# Altium project diplom.PrjPcb
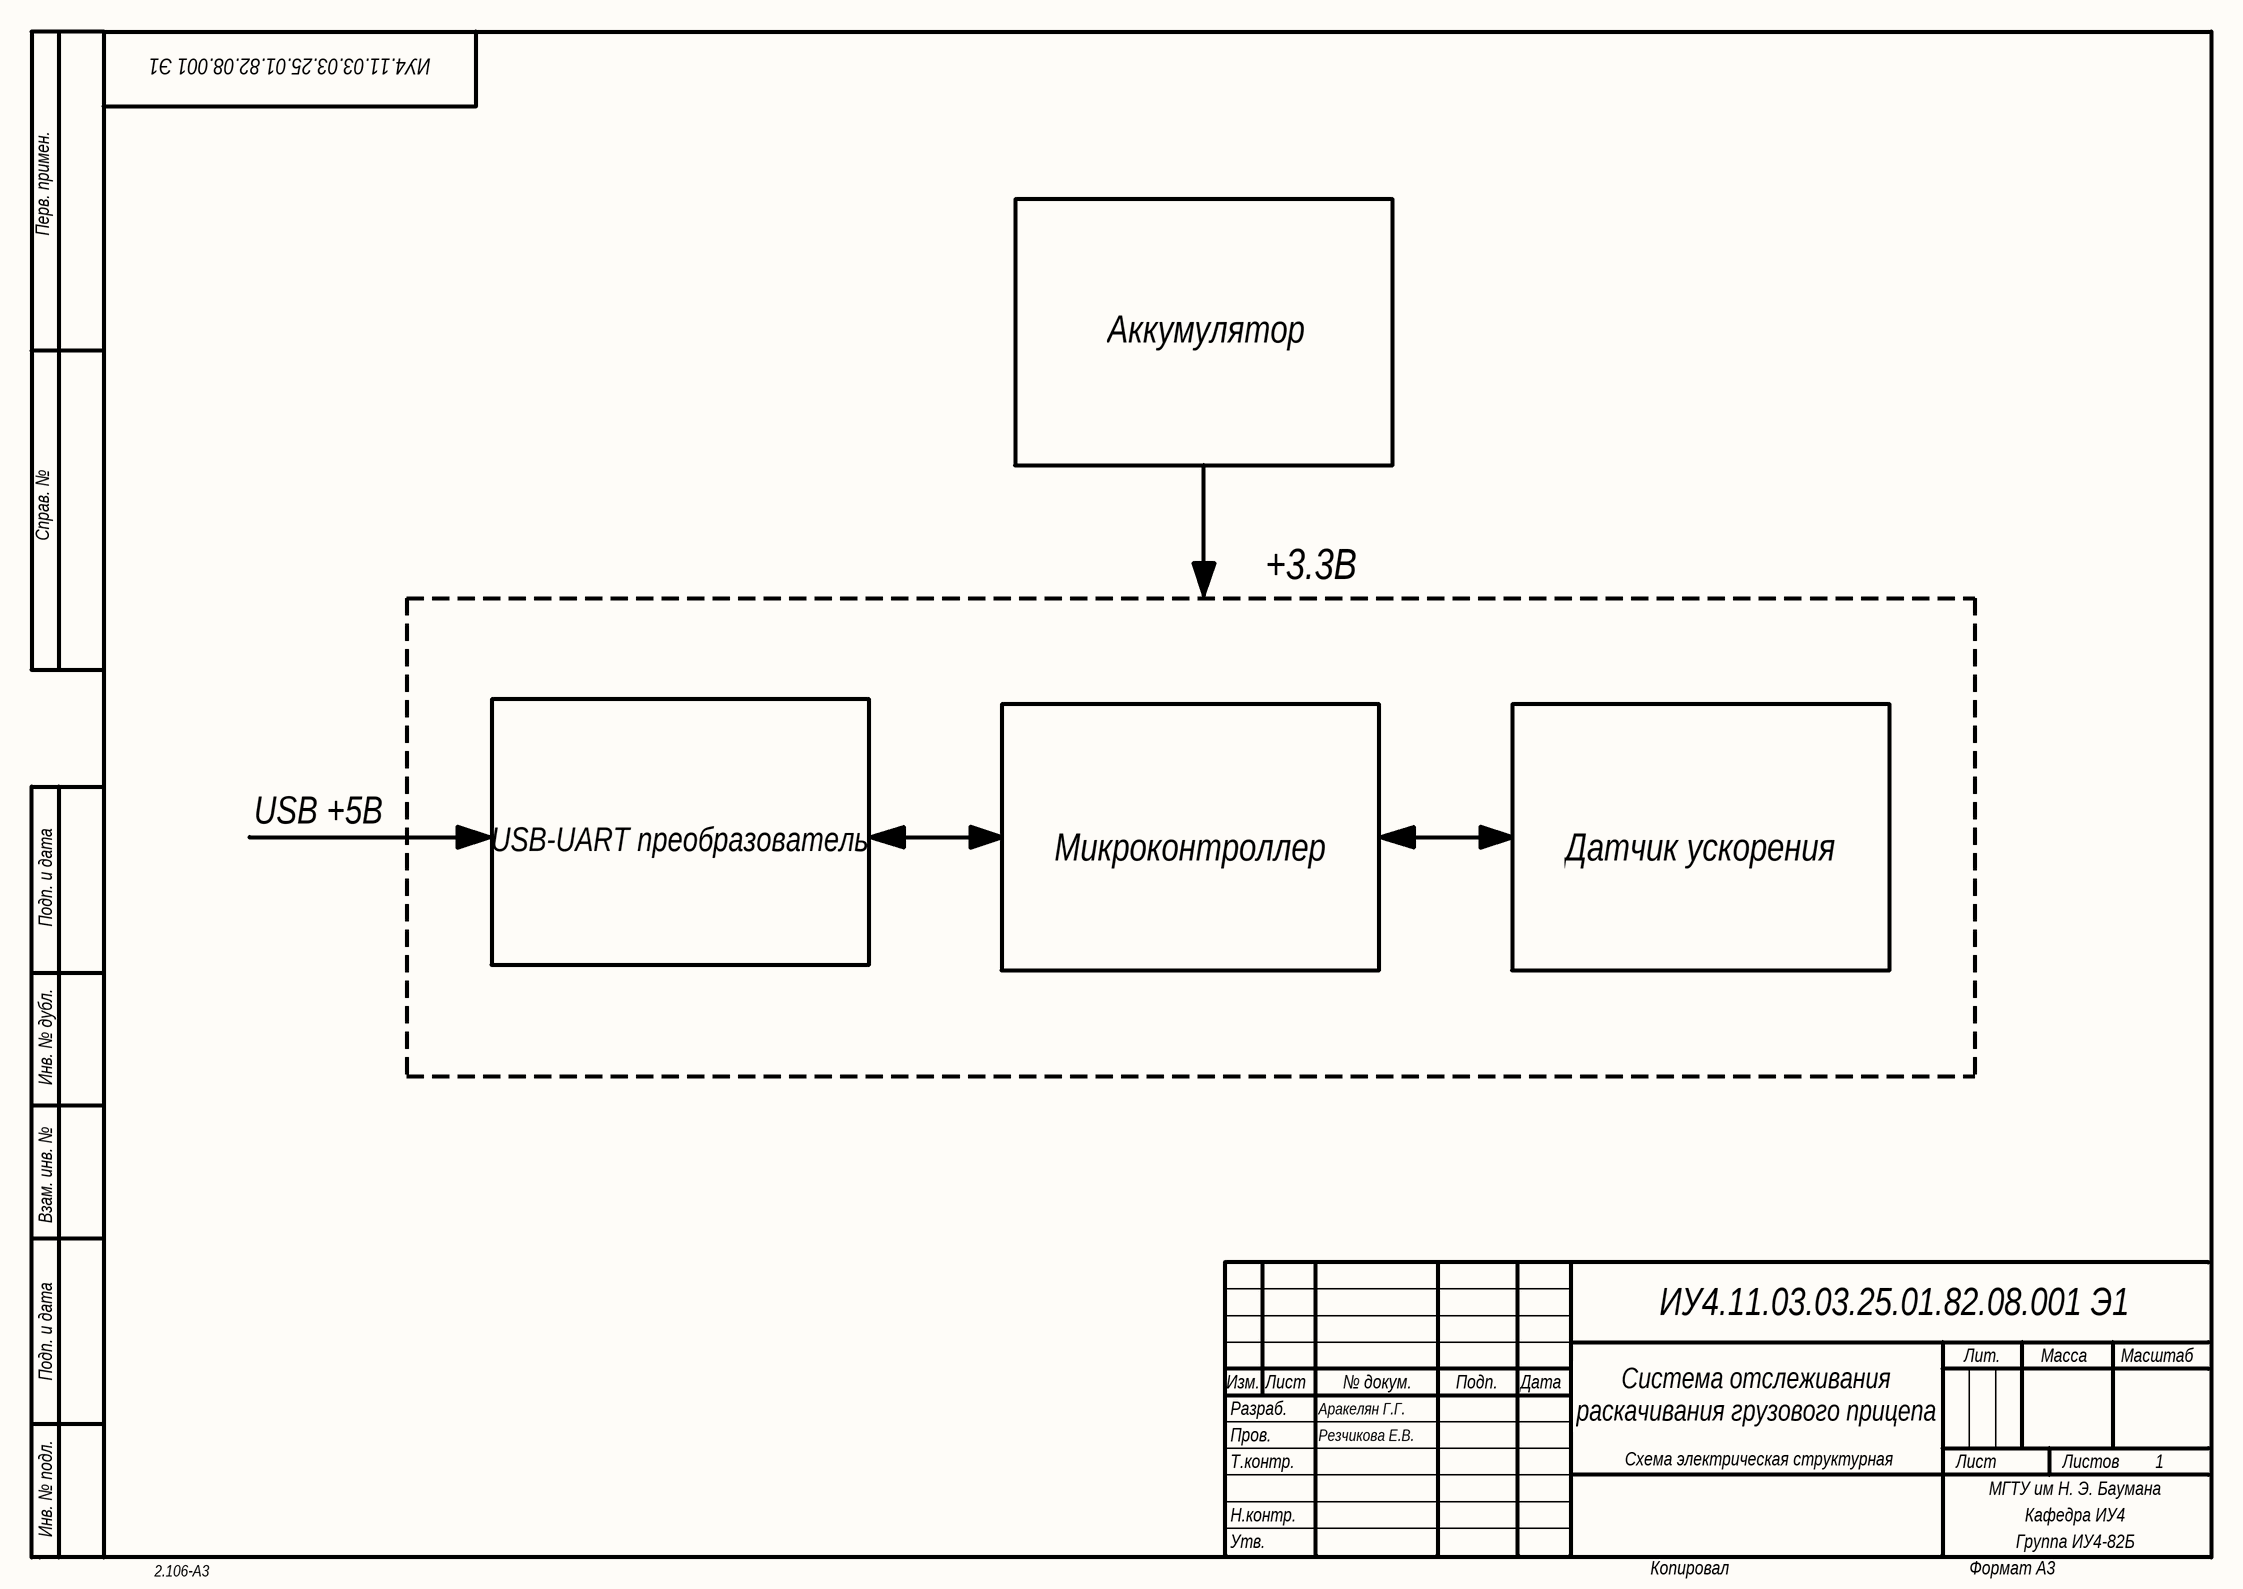
[diagram p0: Э1_diplom.SchDoc]
3 sheets, 40 parts. Net scope: global (net labels, ports and power ports of the same name join across sheets).
Board file: PCB1.PcbDoc
Sheets:
  Э1_diplom.SchDoc
  Э2_diplom.SchDoc
  Э3_diplom.SchDoc

## Sheet Э1_diplom.SchDoc
size 420 x 297 mm; CheckedBy: Резчикова Е.В.; Author: Аракелян Г.Г.; CompanyName: ИУ4.11.03.03.25.01.82.08.001 Э1; Address1: Схема электрическая структурная; SheetNumber: 1; SheetTotal: 3

### Notes on the sheet
- Аккумулятор
- +3.3В
- USB +5В
- USB-UART преобразователь
- Микроконтроллер
- Датчик ускорения
- Система отслеживания раскачивания грузового прицепа
- Перв. примен.
- Справ. №
- Подп. и дата
- Инв. № дубл.
- Взам. инв. №
- Разраб.
- Изм.
- Лист
- № докум.
- Подп.
- Дата
- Лит.
- Масса
- Масштаб
- Пров.
- Т.контр.
- Листов
- 1
- Инв. № подл.
- Утв.
- Н.контр.
- МГТУ им Н. Э. Баумана
- Группа ИУ4-82Б
- Кафедра ИУ4
- 2.106-A3
- Копировал
- Формат А3

## Sheet Э2_diplom.SchDoc
size 420 x 297 mm; CheckedBy: Резчикова Е.В.; Author: Аракелян Г.Г.; CompanyName: ИУ4.11.03.03.25.01.82.08.001 Э2; Address1: Схема электрическая функциональная; SheetNumber: 2; SheetTotal: 3
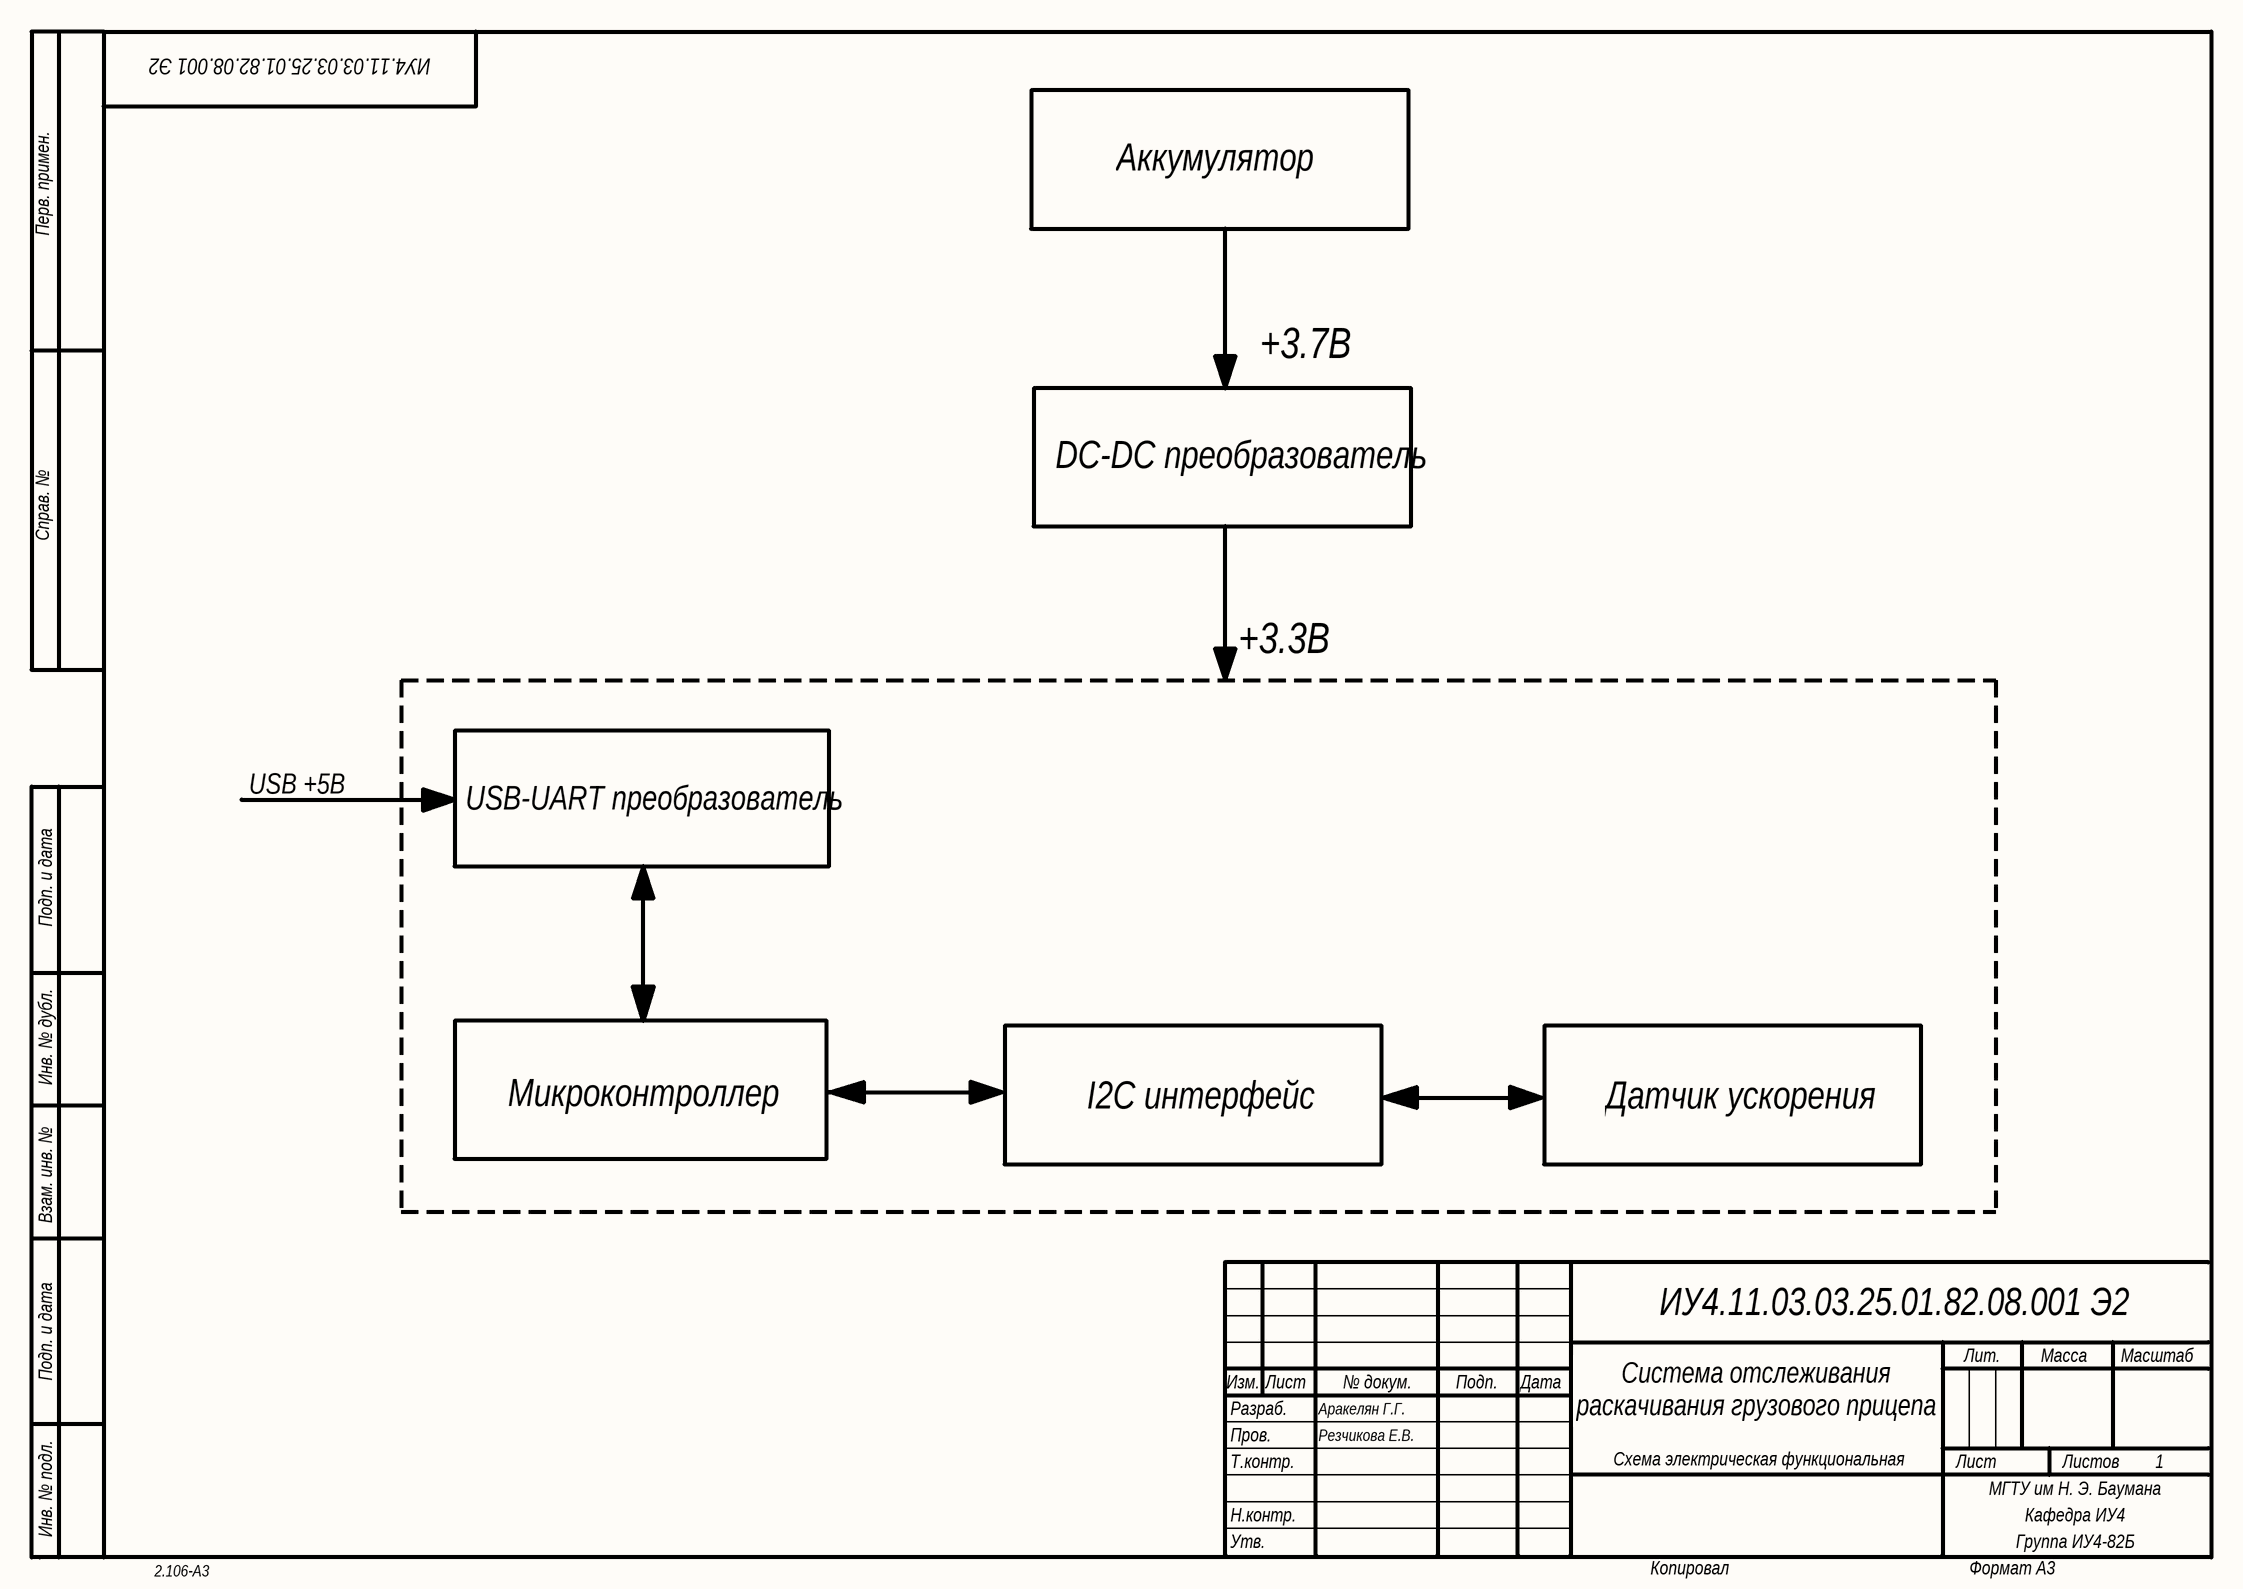
[diagram p1: Э2_diplom.SchDoc]

### Notes on the sheet
- Аккумулятор
- +3.7В
- DC-DC преобразователь
- +3.3В
- USB +5В
- USB-UART преобразователь
- Микроконтроллер
- I2C интерфейс
- Датчик ускорения
- Система отслеживания раскачивания грузового прицепа
- Перв. примен.
- Справ. №
- Подп. и дата
- Инв. № дубл.
- Взам. инв. №
- Разраб.
- Изм.
- Лист
- № докум.
- Подп.
- Дата
- Лит.
- Масса
- Масштаб
- Пров.
- Т.контр.
- Листов
- 1
- Инв. № подл.
- Утв.
- Н.контр.
- МГТУ им Н. Э. Баумана
- Группа ИУ4-82Б
- Кафедра ИУ4
- 2.106-A3
- Копировал
- Формат А3

## Sheet Э3_diplom.SchDoc
size 420 x 297 mm; CheckedBy: Резчикова Е.В.; Author: Аракелян Г.Г.; CompanyName: ИУ4.11.03.03.25.01.82.08.001 Э3; Address1: Схема электрическая принципиальная; SheetNumber: 3; SheetTotal: 3
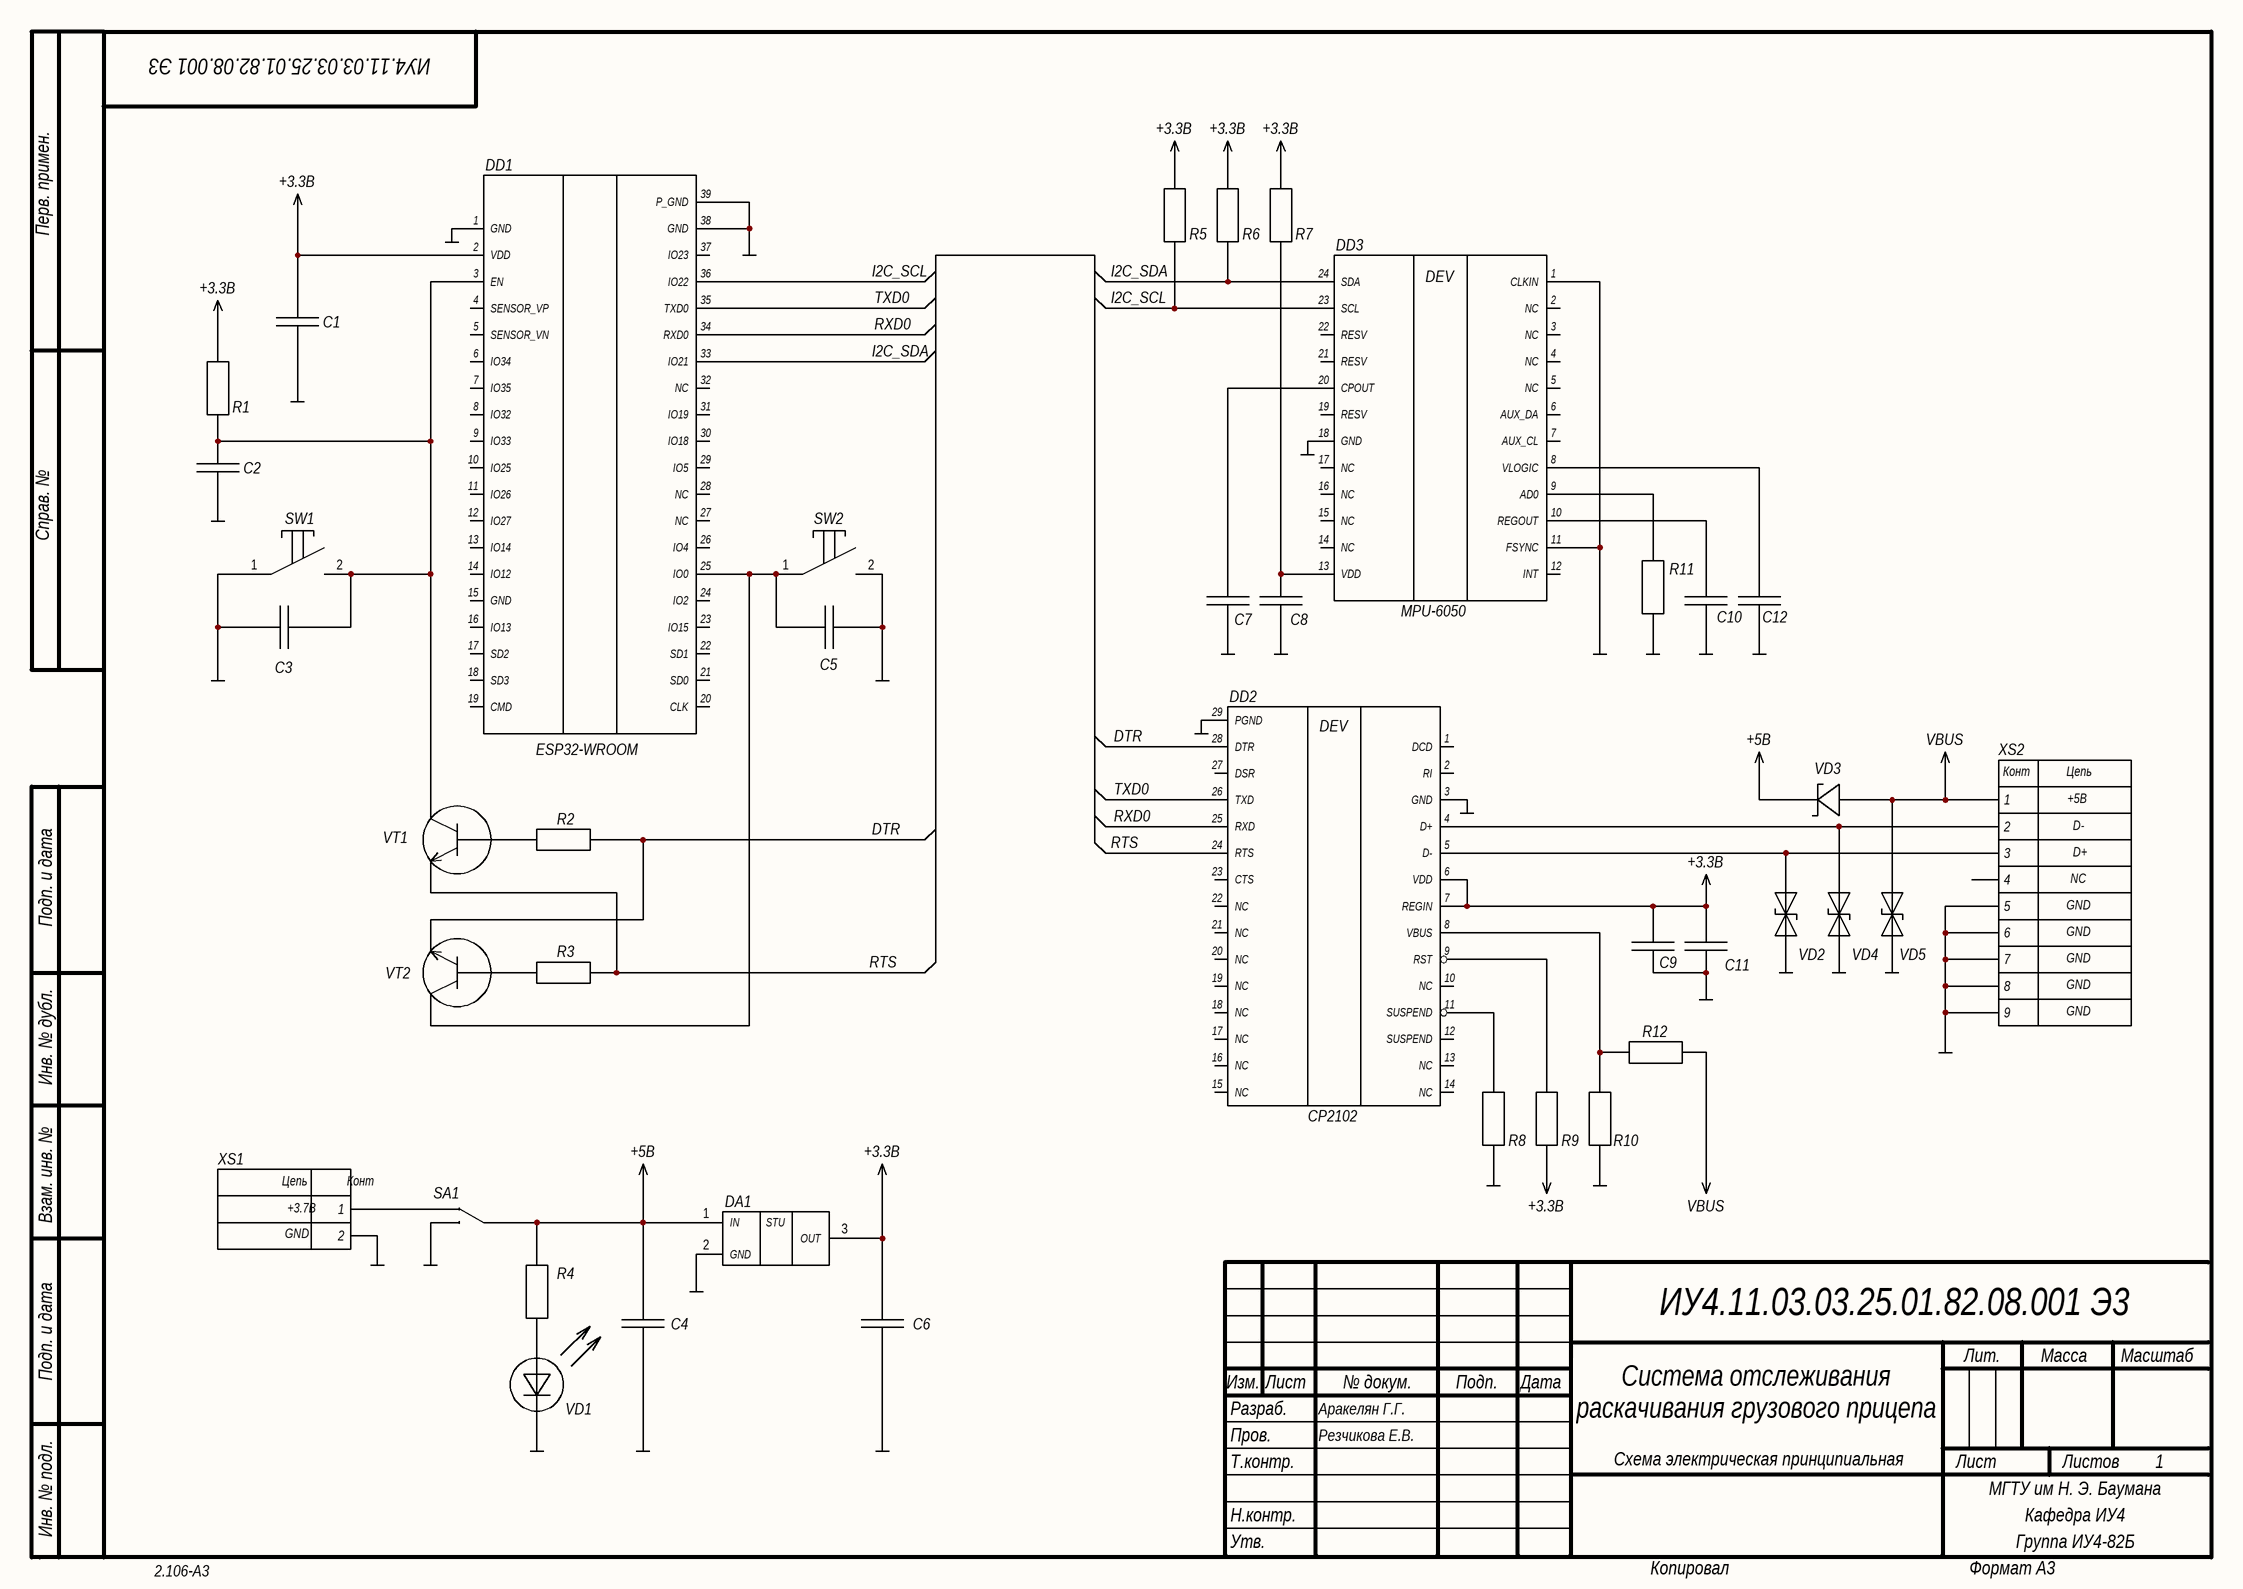
[diagram p2: Э3_diplom.SchDoc]

### Parts
C1  (no value)  [CAP: 0805]
C2  (no value)  [CAP: 0805]
C3  (no value)  [CAP: 0805]
C4  (no value)  [CAP: 0805]
C5  (no value)  [CAP: 0805]
C6  (no value)  [CAP: 0805]
C7  (no value)  [CAP: 0805]
C8  (no value)  [CAP: 0805]
C9  (no value)  [CAP: 0805]
C10  (no value)  [CAP: 0805]
C11  (no value)  [CAP: 0805]
C12  (no value)  [CAP: 0805]
DA1  AP2138N  [SOT-23]  (value not drawn)
DD1  ESP32-WROOM  [ESP32-S3-WROOM-1-N16R2 - duplicate]
DD2  CP2102  [CP2102]
DD3  MPU-6050  [MPU-6050]
R1  (no value)  [RES: 0805]
R2  (no value)  [RES: 0805]
R3  (no value)  [RES: 0805]
R4  (no value)  [RES: 0805]
R5  (no value)  [RES: 0805]
R6  (no value)  [RES: 0805]
R7  (no value)  [RES: 0805]
R8  (no value)  [RES: 0805]
R9  (no value)  [RES: 0805]
R10  (no value)  [RES: 0805]
R11  (no value)  [RES: 0805]
R12  (no value)  [RES: 0805]
SA1  Switch ON-ON  [BUT: MTS-102]  (value not drawn)
SW1  Button  [BUT: SMD 6x6 H4.3]  (value not drawn)
SW2  Button  [BUT: SMD 6x6 H4.3]  (value not drawn)
VD1  (no value)  [LED: 0805]
VD2  Suppressor-Bi  [DIOD-523]  (value not drawn)
VD3  Stab  [BAT760-7]  (value not drawn)
VD4  Suppressor-Bi  [DIOD-523]  (value not drawn)
VD5  Suppressor-Bi  [DIOD-523]  (value not drawn)
VT1  BJT-NPN  [SOT-23]  (value not drawn)
VT2  BJT-NPN  [SOT-23]  (value not drawn)
XS1  bat  [Li-Po]  (value not drawn)
XS2  USB con  [MicroUSB]  (value not drawn)

### Nets
+3.3В: C1.1 C6.1 C9.1 C11.1 DA1.3(OUT) DD1.2(VDD) DD2.6(VDD) DD2.7(REGIN) R1.1 R5.1 R6.1 R7.1 R9.2
+5В: C4.1 DA1.1(IN) R4.1 SA1.2(PIN0) VD3.2(К)
GND: C1.2 C2.2 C3.1 C4.2 C5.2 C6.2 C7.2 C8.2 C9.2 C10.2 C11.2 C12.2 DA1.2(GND) DD1.1(GND) DD1.38(GND) DD1.39(P_GND) DD2.3(GND) DD2.29(PGND) DD3.1(CLKIN) DD3.11(FSYNC) DD3.18(GND) R8.2 R10.2 R11.2 SA1.3(PIN1) SW1.1 SW2.2 VD1.2(C) VD2.2(К) VD4.2(К) VD5.2(К) XS1.2 XS2.5 XS2.6
VBUS: R12.2 VD3.1(А) VD5.1(А) XS2.1
DTR: DD2.28(DTR) R2.1 VT2.3(Э)
I2C_SCL: DD1.36(IO22) DD3.23(SCL) R5.2
I2C_SDA: DD1.33(IO21) DD3.24(SDA) R6.2
RTS: DD2.24(RTS) R3.1 VT1.3(Э)
RXD0: DD1.34(RXD0) DD2.25(RXD)
TXD0: DD1.35(TXD0) DD2.26(TXD)
NetC2_1: C2.1 C3.2 DD1.3(EN) R1.2 SW1.2 VT1.2(К)
NetC5_1: C5.1 DD1.25(IO0) SW2.1 VT2.2(К)
NetC7_1: C7.1 DD3.20(CPOUT)
NetC8_1: C8.1 DD3.13(VDD) R7.2
NetC10_1: C10.1 DD3.10(REGOUT)
NetC12_1: C12.1 DD3.8(VLOGIC)
NetDD2_4: DD2.4(D+) VD4.1(А) XS2.2
NetDD2_5: DD2.5(D-) VD2.1(А) XS2.3
NetDD2_8: DD2.8(VBUS) R10.1 R12.1
NetDD2_9: DD2.9(RST) R9.1
NetDD2_11: DD2.11(SUSPEND) R8.1
NetDD3_9: DD3.9(AD0) R11.1
NetR2_2: R2.2 VT1.1(Б)
NetR3_2: R3.2 VT2.1(Б)
NetR4_2: R4.2 VD1.1(A)
NetSA1_1: SA1.1(PIN1) XS1.1

Not connected (* = marked no-connect by the designer): DD1 4(SENSOR_VP) 5(SENSOR_VN) 6(IO34) 7(IO35) 8(IO32) 9(IO33) 10(IO25) 11(IO26) 12(IO27) 13(IO14) 14(IO12) 15(GND) 16(IO13) 17(SD2) 18(SD3) 19(CMD) 20(CLK) 21(SD0) 22(SD1) 23(IO15) 24(IO2) 26(IO4) 27(NC) 28(NC) 29(IO5) 30(IO18) 31(IO19) 32(NC) 37(IO23); DD2 1(DCD) 2(RI) 10(NC) 12(SUSPEND) 13(NC) 14(NC) 15(NC) 16(NC) 17(NC) 18(NC) 19(NC) 20(NC) 21(NC) 22(NC) 23(CTS) 27(DSR); DD3 2(NC) 3(NC) 4(NC) 5(NC) 6(AUX_DA) 7(AUX_CL) 12(INT) 14(NC) 15(NC) 16(NC) 17(NC) 19(RESV) 21(RESV) 22(RESV); XS2 4

### Notes on the sheet
- Система отслеживания раскачивания грузового прицепа
- Перв. примен.
- Справ. №
- Подп. и дата
- Инв. № дубл.
- Взам. инв. №
- Разраб.
- Изм.
- Лист
- № докум.
- Подп.
- Дата
- Лит.
- Масса
- Масштаб
- Пров.
- Т.контр.
- Листов
- 1
- Инв. № подл.
- Утв.
- Н.контр.
- МГТУ им Н. Э. Баумана
- Группа ИУ4-82Б
- Кафедра ИУ4
- 2.106-A3
- Копировал
- Формат А3
- (in symbol bat) Цепь; Конт; +3.7В; GND
- (in symbol CP2102) DEV
- (in symbol DC-DC 3.3V) STU
- (in symbol Micro USB) Конт; Цепь; +5В; D-; D+; NC; GND
- (in symbol MPU-6050) DEV

### Library data of the parts
C1-C12 = Cap
DA1 = DC-DC 3.3V: Published: 13.08.2015; Publisher: Andrew Danich; Type: Микросхема
DD1 = ESP32-WROVER-B
R1-R12 = res
SA1 = Switch ON-ON: Switch, ON-ON; Manufacturer: Jietong Switch; PartNumber: MTC-102; Package: MTC-102-A3
VD1 = LED
VD2 VD4 VD5 = Suppressor-Bi: Type: Супрессор; Published: 27.07.2015; Publisher: Andrew Danich
VD3 = Stab: Type: Диод; Published: 18.05.2010; Publisher: Andrew Danich
VT1 VT2 = BJT-NPN: Type: Транзистор; Published: 07.05.2013; Publisher: Andrew Danich
XS2 = Micro USB